# EAGLE design RMP - FBPS MOBO 0.0.1 (EAGLE 9.6.2)

## Sheet 1 of 4
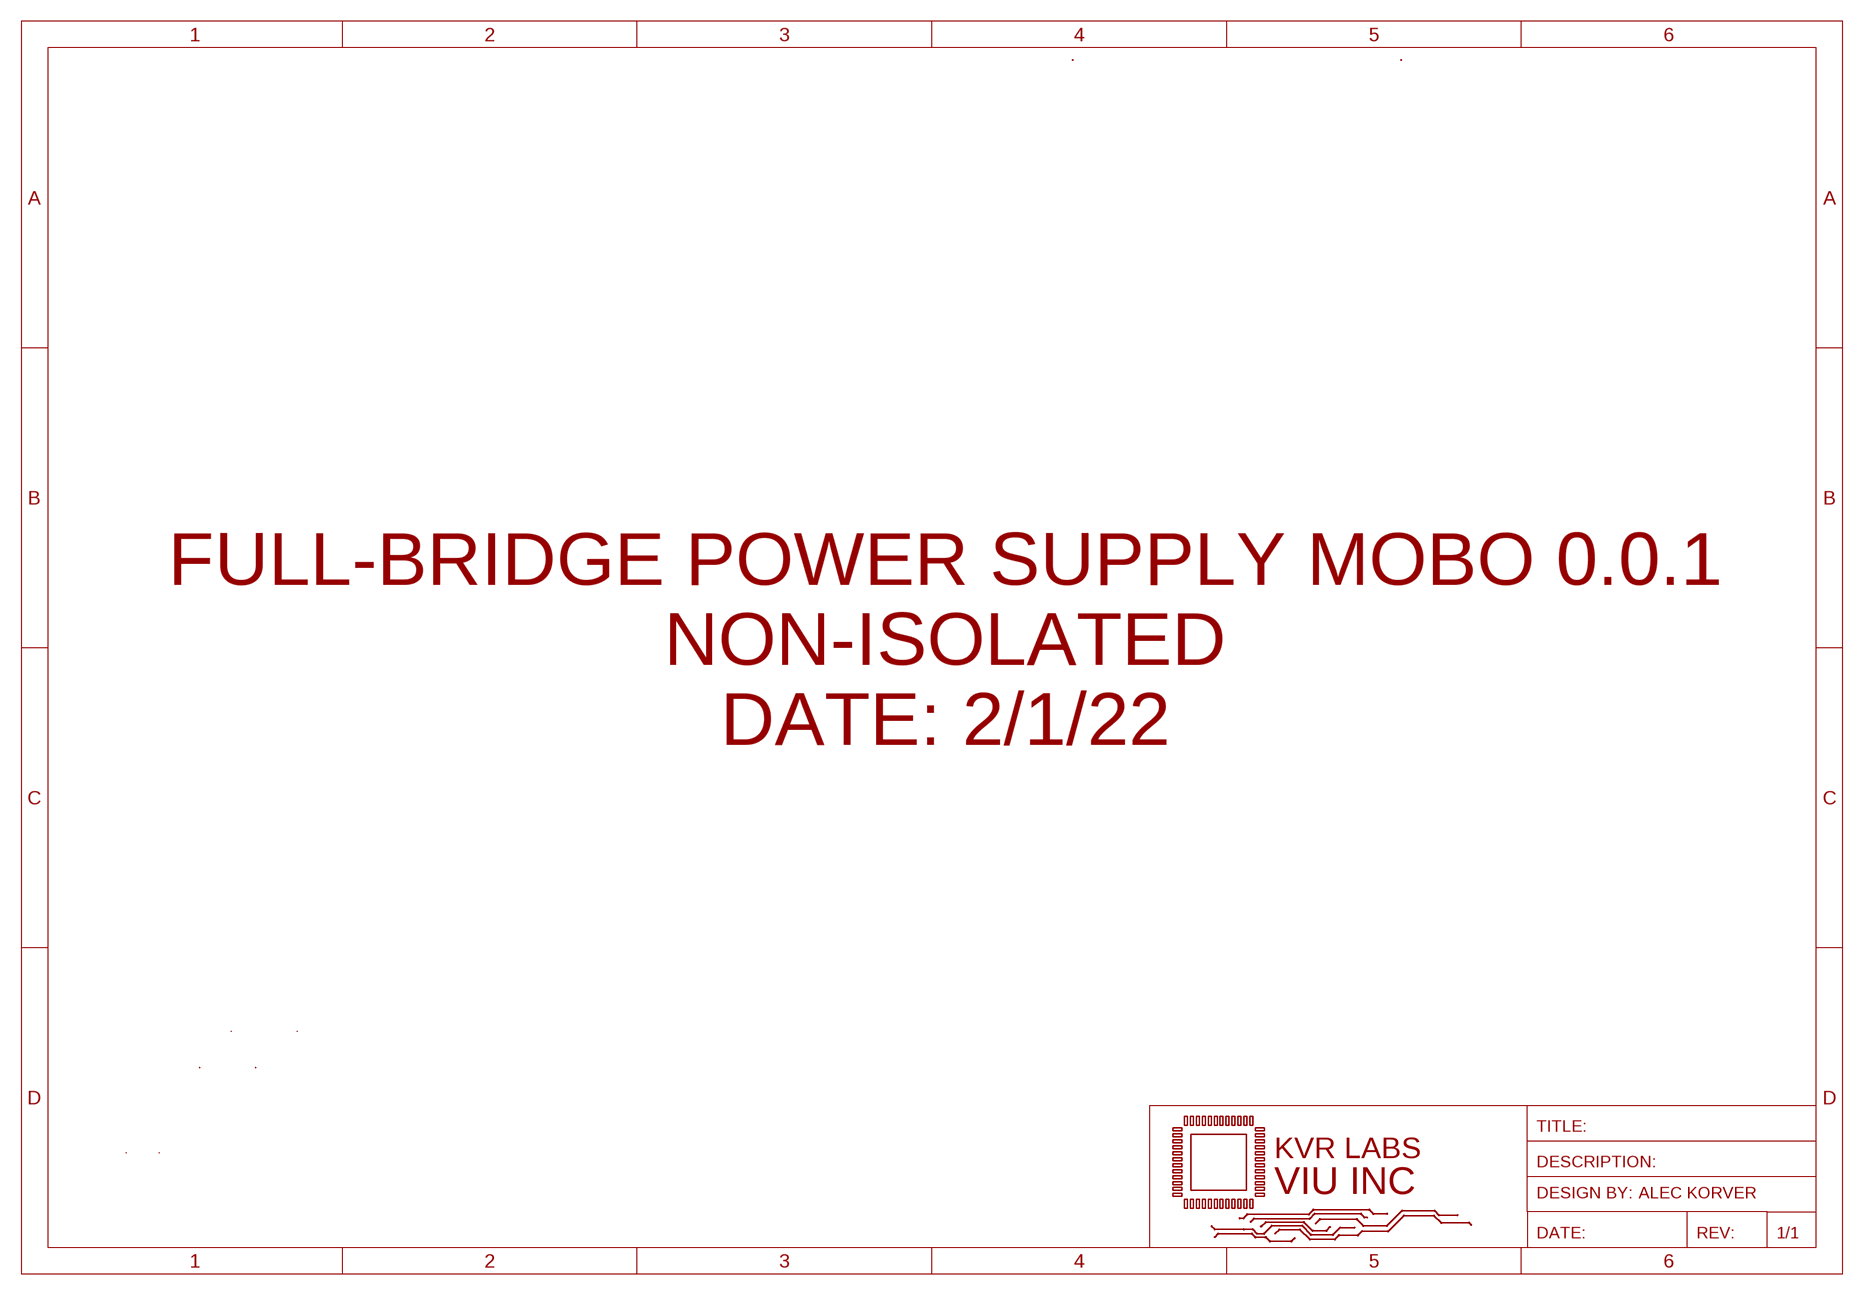
[diagram p0: schematic, sheet 1]

### Notes on the sheet
- FULL-BRIDGE POWER SUPPLY MOBO 0.0.1
  NON-ISOLATED
  DATE: 2/1/22

## Sheet 2 of 4: H BRIDGE - AC/DC STAGE
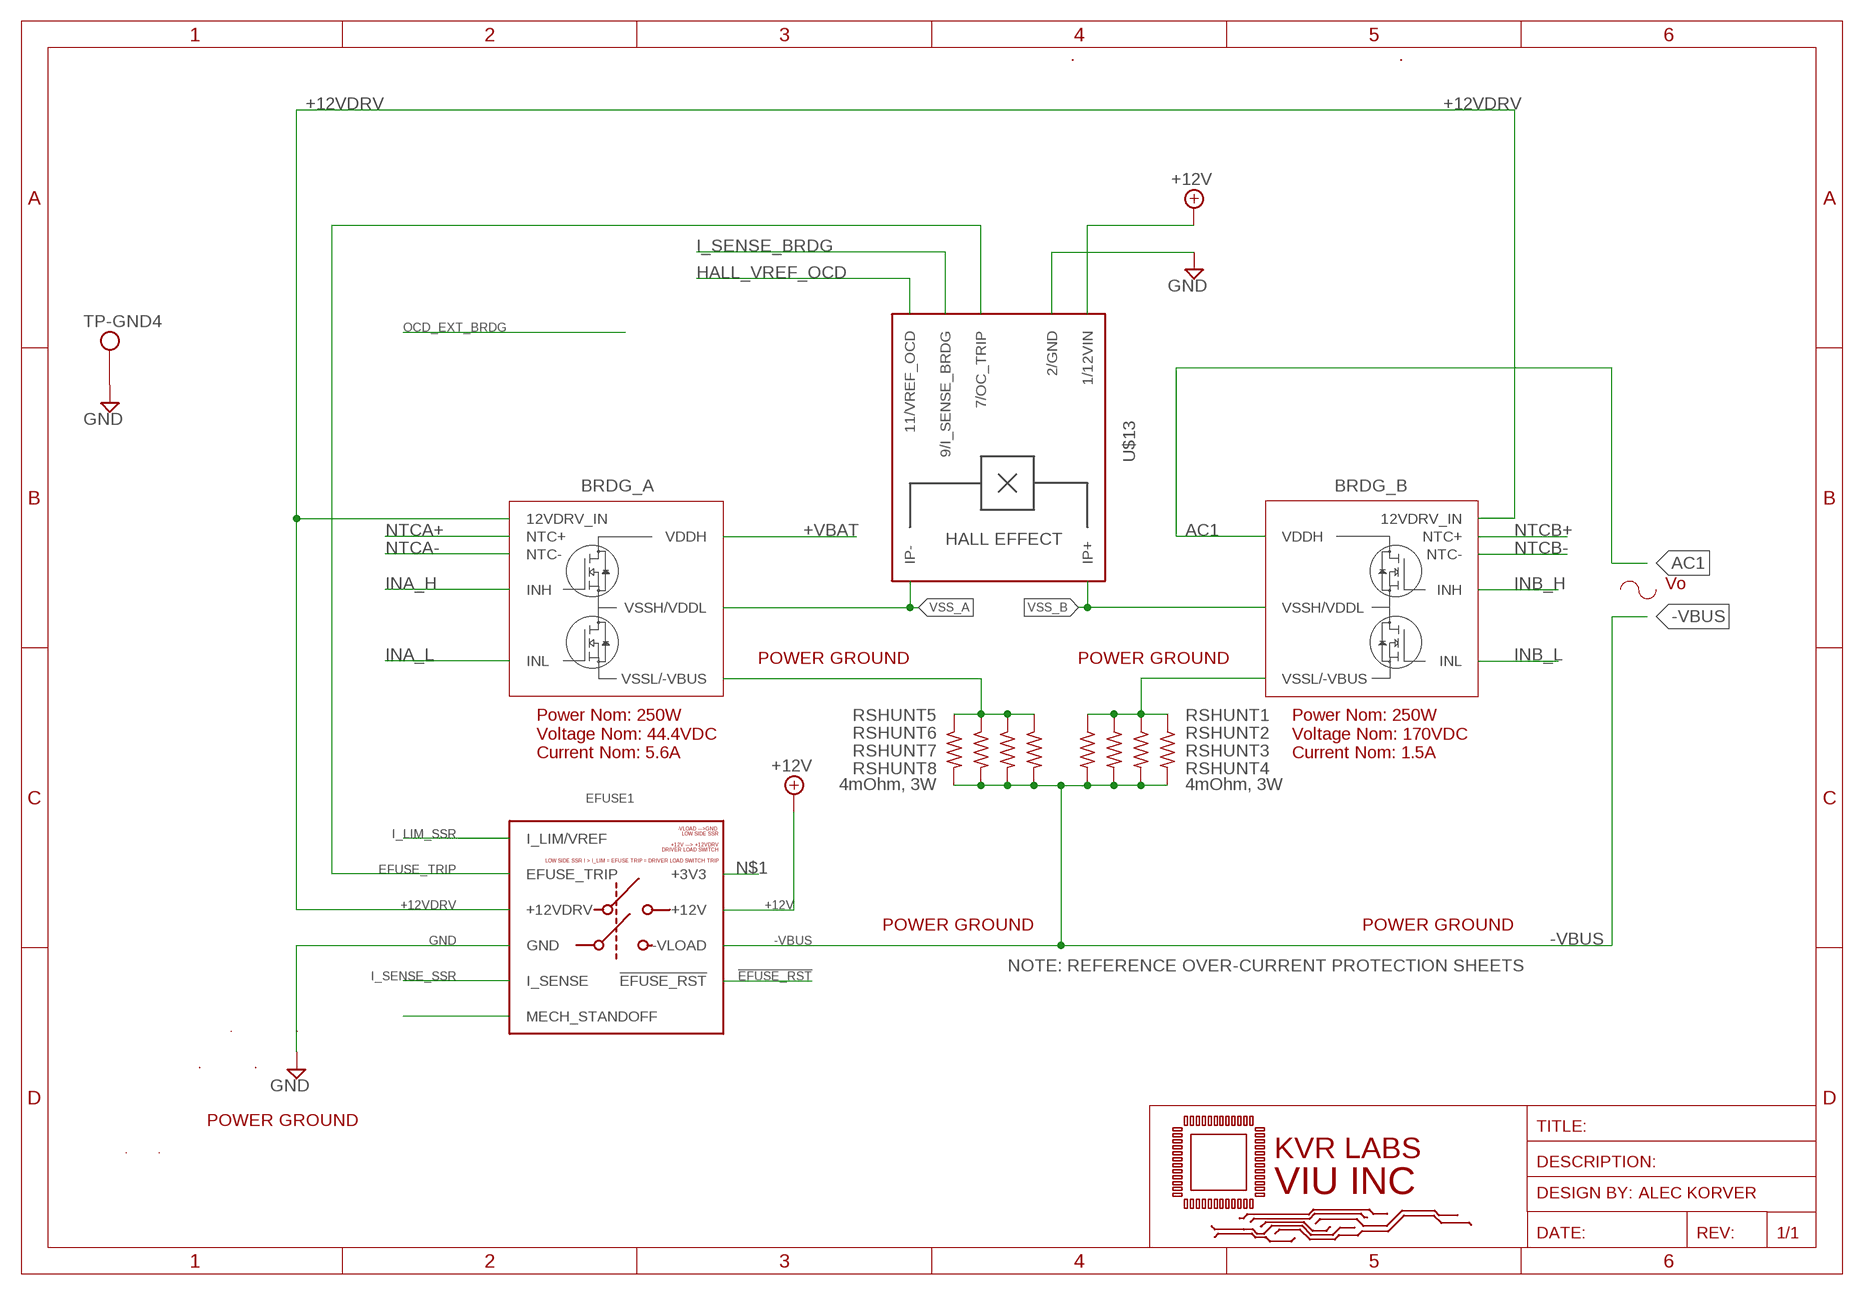
[diagram p1: schematic, sheet 2]

### Parts
BRDG_A  1/2BRIDGE  [1/2BRIDGE]
BRDG_B  1/2BRIDGE  [1/2BRIDGE]
EFUSE1  EFUSE_2.0.0  [EFUSE_2.0.0]
RSHUNT1  4mOhm, 3W  R-US_R2512  [R2512]
RSHUNT2  4mOhm, 3W  R-US_R2512  [R2512]
RSHUNT3  4mOhm, 3W  R-US_R2512  [R2512]
RSHUNT4  4mOhm, 3W  R-US_R2512  [R2512]
RSHUNT5  4mOhm, 3W  R-US_R2512  [R2512]
RSHUNT6  4mOhm, 3W  R-US_R2512  [R2512]
RSHUNT7  4mOhm, 3W  R-US_R2512  [R2512]
RSHUNT8  4mOhm, 3W  R-US_R2512  [R2512]
TP-GND4  THM_TESTPOINT_5000_SERIES  [THM-TESTPOINT]
U$13  HALL_EFFECT_CURRENT_MONITOR  [HALL_CURRENT_MONITOR]

### Nets
!EFUSE_RST: EFUSE1.12/!EFUSE_RST(!EFUSE_RST) ; also sheet 3
+12V: EFUSE1.11/12VIN(+12V) U$13.1/+12VIN(1/12VIN) ; also sheet 3
+12VDRV: BRDG_A.11/+12DRVR(12VDRV_IN) BRDG_B.11/+12DRVR(12VDRV_IN) EFUSE1.12/12VDRV(+12VDRV)
+VBAT: BRDG_A.1/VDDA(VDDH) BRDG_A.2/VDDA(VDDH) BRDG_A.3/VDDA(VDDH) BRDG_A.4/VDDA(VDDH) ; also sheet 3
-VBUS: EFUSE1.1/-VLOAD(-VLOAD) EFUSE1.2/-VLOAD(-VLOAD) EFUSE1.3/-VLOAD(-VLOAD) EFUSE1.4/-VLOAD(-VLOAD) EFUSE1.5/-VLOAD(-VLOAD) EFUSE1.6/-VLOAD(-VLOAD) EFUSE1.7/-VLOAD(-VLOAD) EFUSE1.8/-VLOAD(-VLOAD) RSHUNT1.2 RSHUNT2.2 RSHUNT3.2 RSHUNT4.2 RSHUNT5.2 RSHUNT6.2 RSHUNT7.2 RSHUNT8.2 ; also sheet 3,4
AC1: BRDG_B.1/VDDA(VDDH) BRDG_B.2/VDDA(VDDH) BRDG_B.3/VDDA(VDDH) BRDG_B.4/VDDA(VDDH) ; also sheet 3
EFUSE_TRIP: EFUSE1.10/EFUSE_TRIP(EFUSE_TRIP) U$13.7/EFUSE_TRIP(7/OC_TRIP) ; also sheet 3
GND: EFUSE1.1/GND(GND) EFUSE1.2/GND(GND) EFUSE1.3/GND(GND) EFUSE1.4/GND(GND) EFUSE1.5/GND(GND) EFUSE1.6/GND(GND) EFUSE1.7/GND(GND) EFUSE1.8/GND(GND) EFUSE1.9/GND(GND) TP-GND4.P1 U$13.2/GND U$13.3/GND(2/GND) ; also sheet 3,4
HALL_VREF_OCD: U$13.11/VREF_OCD
I_LIM_SSR: EFUSE1.11/VREF(I_LIM/VREF) ; also sheet 3
I_SENSE_BRDG: U$13.9/I_SENSE_BRDG ; also sheet 3
I_SENSE_SSR: EFUSE1.9/-VLOAD_SW(I_SENSE) ; also sheet 3
INA_H: BRDG_A.10/IN_H(INH) ; also sheet 3
INA_L: BRDG_A.9/IN_L(INL) ; also sheet 3
INB_H: BRDG_B.10/IN_H(INH) ; also sheet 3
INB_L: BRDG_B.9/IN_L(INL) ; also sheet 3
N$1: EFUSE1.10/+3V3(+3V3)
N$3: BRDG_A.9/-VBUS(VSSL/-VBUS) BRDG_A.10/-VBUS(VSSL/-VBUS) BRDG_A.11/-VBUS(VSSL/-VBUS) BRDG_A.12/-VBUS(VSSL/-VBUS) RSHUNT5.1 RSHUNT6.1 RSHUNT7.1 RSHUNT8.1
N$4: BRDG_B.9/-VBUS(VSSL/-VBUS) BRDG_B.10/-VBUS(VSSL/-VBUS) BRDG_B.11/-VBUS(VSSL/-VBUS) BRDG_B.12/-VBUS(VSSL/-VBUS) RSHUNT1.1 RSHUNT2.1 RSHUNT3.1 RSHUNT4.1
N$5: EFUSE1.S1(MECH_STANDOFF) EFUSE1.S2(MECH_STANDOFF)
NTCA+: BRDG_A.7/NTC+(NTC+) ; also sheet 3
NTCA-: BRDG_A.8/NTC-(NTC-) ; also sheet 3
NTCB+: BRDG_B.7/NTC+(NTC+) ; also sheet 3
NTCB-: BRDG_B.8/NTC-(NTC-) ; also sheet 3
VSS_A: BRDG_A.1/VSSA(VSSH/VDDL) BRDG_A.2/VSSA(VSSH/VDDL) BRDG_A.3/VSSA(VSSH/VDDL) BRDG_A.4/VSSA(VSSH/VDDL) U$13.7/IP-(IP-) U$13.8/IP-(IP-) U$13.9/IP-(IP-) U$13.10/IP-(IP-) U$13.11/IP-(IP-) U$13.12/IP-(IP-) ; also sheet 3
VSS_B: BRDG_B.1/VSSA(VSSH/VDDL) BRDG_B.2/VSSA(VSSH/VDDL) BRDG_B.3/VSSA(VSSH/VDDL) BRDG_B.4/VSSA(VSSH/VDDL) U$13.1/IP+(IP+) U$13.2/IP+(IP+) U$13.3/IP+(IP+) U$13.4/IP+(IP+) U$13.5/IP+(IP+) U$13.6/IP+(IP+) ; also sheet 3

### Notes on the sheet
- Vo
- POWER GROUND | POWER GROUND
- Power Nom: 250W
  Voltage Nom: 44.4VDC
  Current Nom: 5.6A
- Power Nom: 250W
  Voltage Nom: 170VDC
  Current Nom: 1.5A
- POWER GROUND | POWER GROUND
- NOTE: REFERENCE OVER-CURRENT PROTECTION SHEETS
- POWER GROUND

## Sheet 3 of 4: CONNECTORS
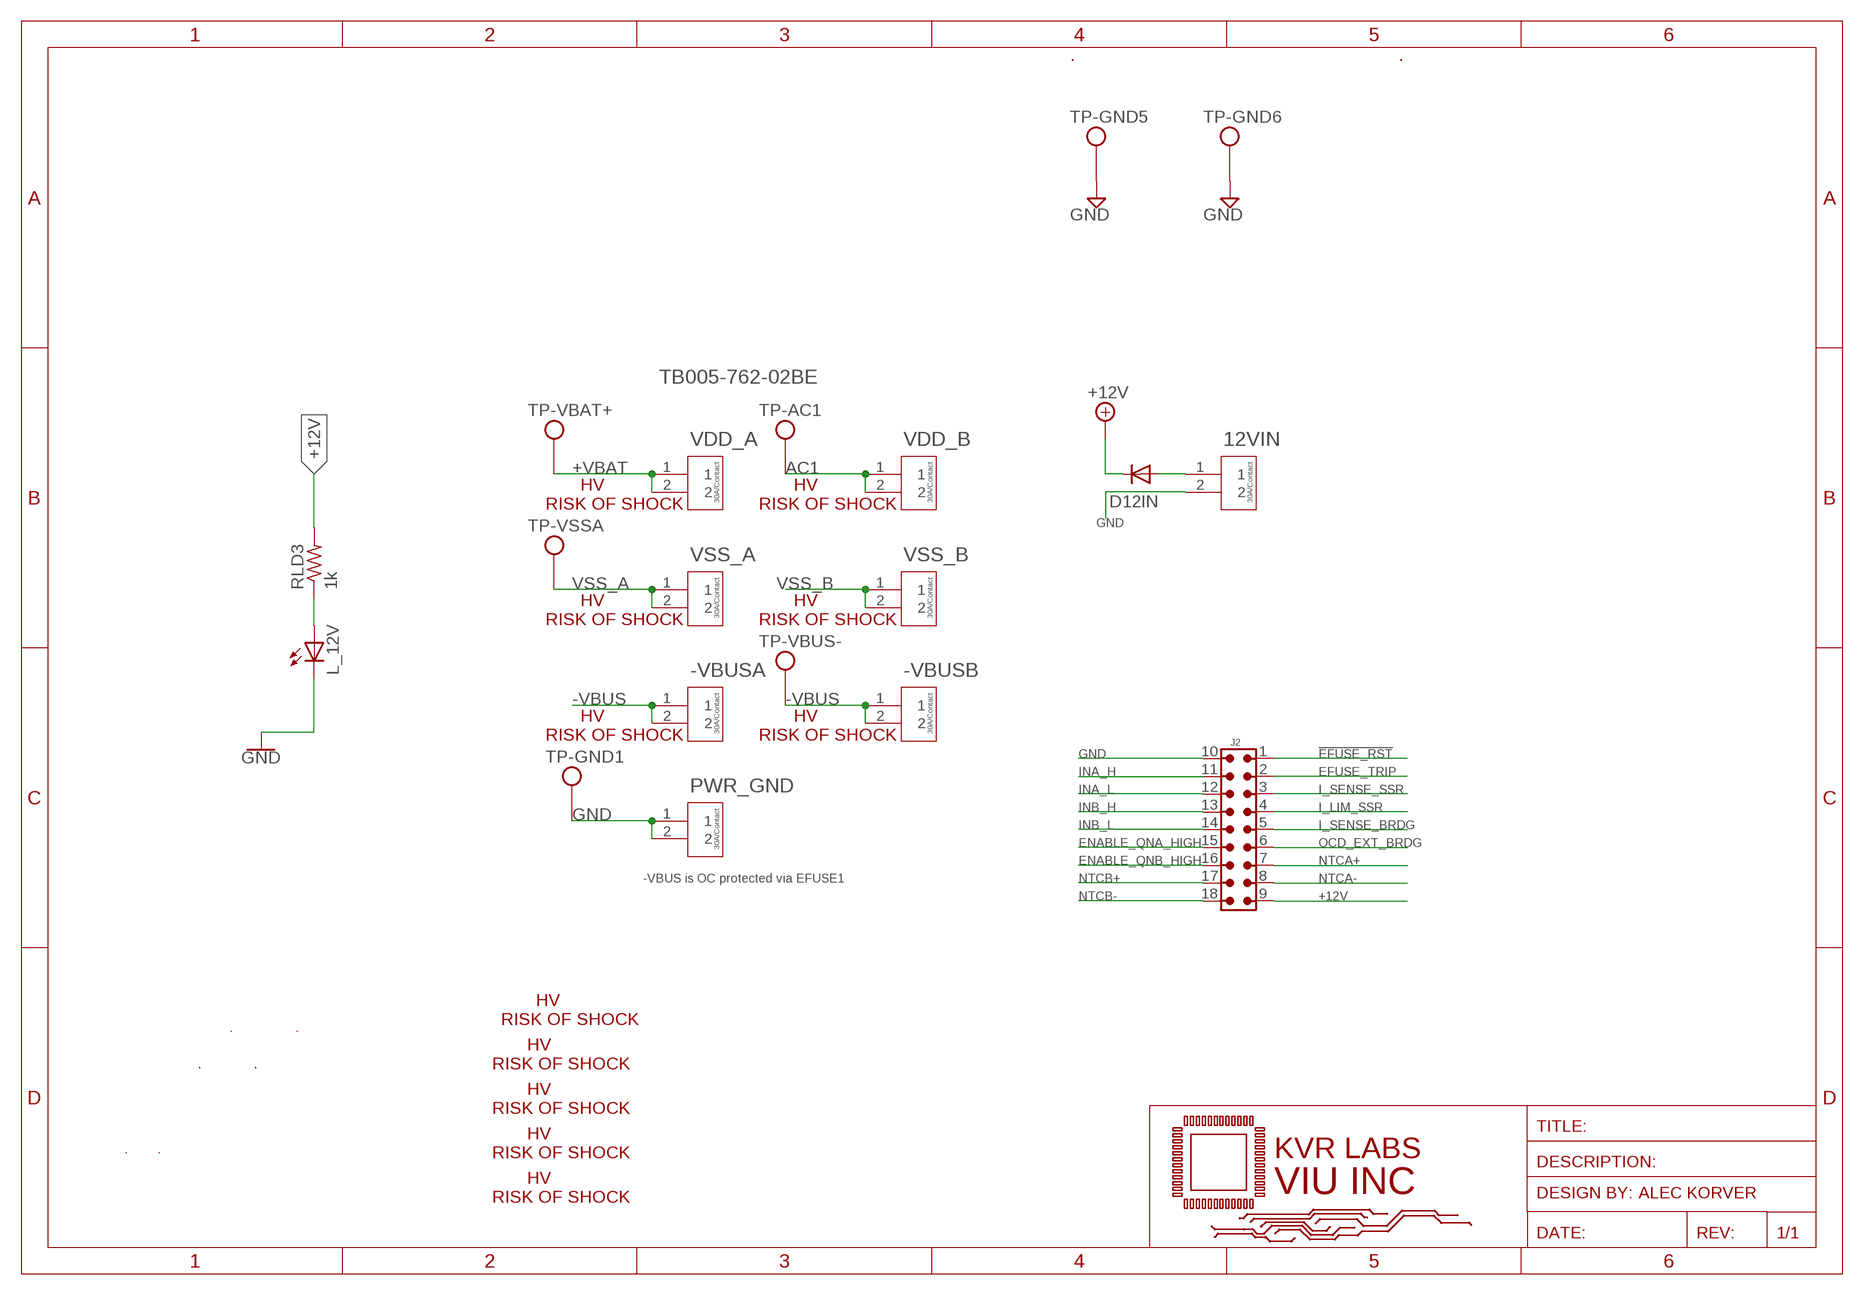
[diagram p2: schematic, sheet 3]

### Parts
12VIN  TB005-762-02BE  [TB005-762-02BE_CUD]
-VBUSA  TB005-762-02BE  [TB005-762-02BE_CUD]
-VBUSB  TB005-762-02BE  [TB005-762-02BE_CUD]
D12IN  DIODESMA  [SMADIODE]
J2  6620XX21022_66201821022  [66201821022]
L_12V  LEDCHIPLED_1206  [CHIPLED_1206]
PWR_GND  TB005-762-02BE  [TB005-762-02BE_CUD]
RLD3  1k  R-US_R1206  [R1206]
TP-AC1  THM_TESTPOINT_5000_SERIES  [THM-TESTPOINT]
TP-GND1  THM_TESTPOINT_5000_SERIES  [THM-TESTPOINT]
TP-GND5  THM_TESTPOINT_5000_SERIES  [THM-TESTPOINT]
TP-GND6  THM_TESTPOINT_5000_SERIES  [THM-TESTPOINT]
TP-VBAT+  THM_TESTPOINT_5000_SERIES  [THM-TESTPOINT]
TP-VBUS-  THM_TESTPOINT_5000_SERIES  [THM-TESTPOINT]
TP-VSSA  THM_TESTPOINT_5000_SERIES  [THM-TESTPOINT]
U$1  ELECTRIC_SHOCK  [ELECTRIC_SHOCK]
U$2  ELECTRIC_SHOCK  [ELECTRIC_SHOCK]
U$3  ELECTRIC_SHOCK  [ELECTRIC_SHOCK]
U$4  ELECTRIC_SHOCK  [ELECTRIC_SHOCK]
U$5  ELECTRIC_SHOCK  [ELECTRIC_SHOCK]
U$6  ELECTRIC_SHOCK  [ELECTRIC_SHOCK]
U$7  ELECTRIC_SHOCK  [ELECTRIC_SHOCK]
U$8  ELECTRIC_SHOCK  [ELECTRIC_SHOCK]
U$9  ELECTRIC_SHOCK  [ELECTRIC_SHOCK]
U$10  ELECTRIC_SHOCK  [ELECTRIC_SHOCK]
U$11  ELECTRIC_SHOCK  [ELECTRIC_SHOCK]
VDD_A  TB005-762-02BE  [TB005-762-02BE_CUD]
VDD_B  TB005-762-02BE  [TB005-762-02BE_CUD]
VSS_A  TB005-762-02BE  [TB005-762-02BE_CUD]
VSS_B  TB005-762-02BE  [TB005-762-02BE_CUD]

### Nets
!EFUSE_RST: J2.1 ; also sheet 2
+12V: D12IN.C J2.9 RLD3.2 ; also sheet 2
+VBAT: TP-VBAT+.P1 VDD_A.1 VDD_A.2 ; also sheet 2
-VBUS: -VBUSA.1 -VBUSA.2 -VBUSB.1 -VBUSB.2 TP-VBUS-.P1 ; also sheet 2,4
AC1: TP-AC1.P1 VDD_B.1 VDD_B.2 ; also sheet 2
EFUSE_TRIP: J2.2 ; also sheet 2
ENABLE_QNA_HIGH: J2.15
ENABLE_QNB_HIGH: J2.16
GND: 12VIN.2 J2.10 L_12V.C PWR_GND.1 PWR_GND.2 TP-GND1.P1 TP-GND5.P1 TP-GND6.P1 ; also sheet 2,4
I_LIM_SSR: J2.4 ; also sheet 2
I_SENSE_BRDG: J2.5 ; also sheet 2
I_SENSE_SSR: J2.3 ; also sheet 2
INA_H: J2.11 ; also sheet 2
INA_L: J2.12 ; also sheet 2
INB_H: J2.13 ; also sheet 2
INB_L: J2.14 ; also sheet 2
N$2: 12VIN.1 D12IN.A
N$20: L_12V.A RLD3.1
NTCA+: J2.7 ; also sheet 2
NTCA-: J2.8 ; also sheet 2
NTCB+: J2.17 ; also sheet 2
NTCB-: J2.18 ; also sheet 2
OCD_EXT_BRDG: J2.6 ; also sheet 2
VSS_A: TP-VSSA.P1 VSS_A.1 VSS_A.2 ; also sheet 2
VSS_B: VSS_B.1 VSS_B.2 ; also sheet 2

### Notes on the sheet
- -VBUS is OC protected via EFUSE1

## Sheet 4 of 4: CERAMIC DC LINK CAPACITANCE
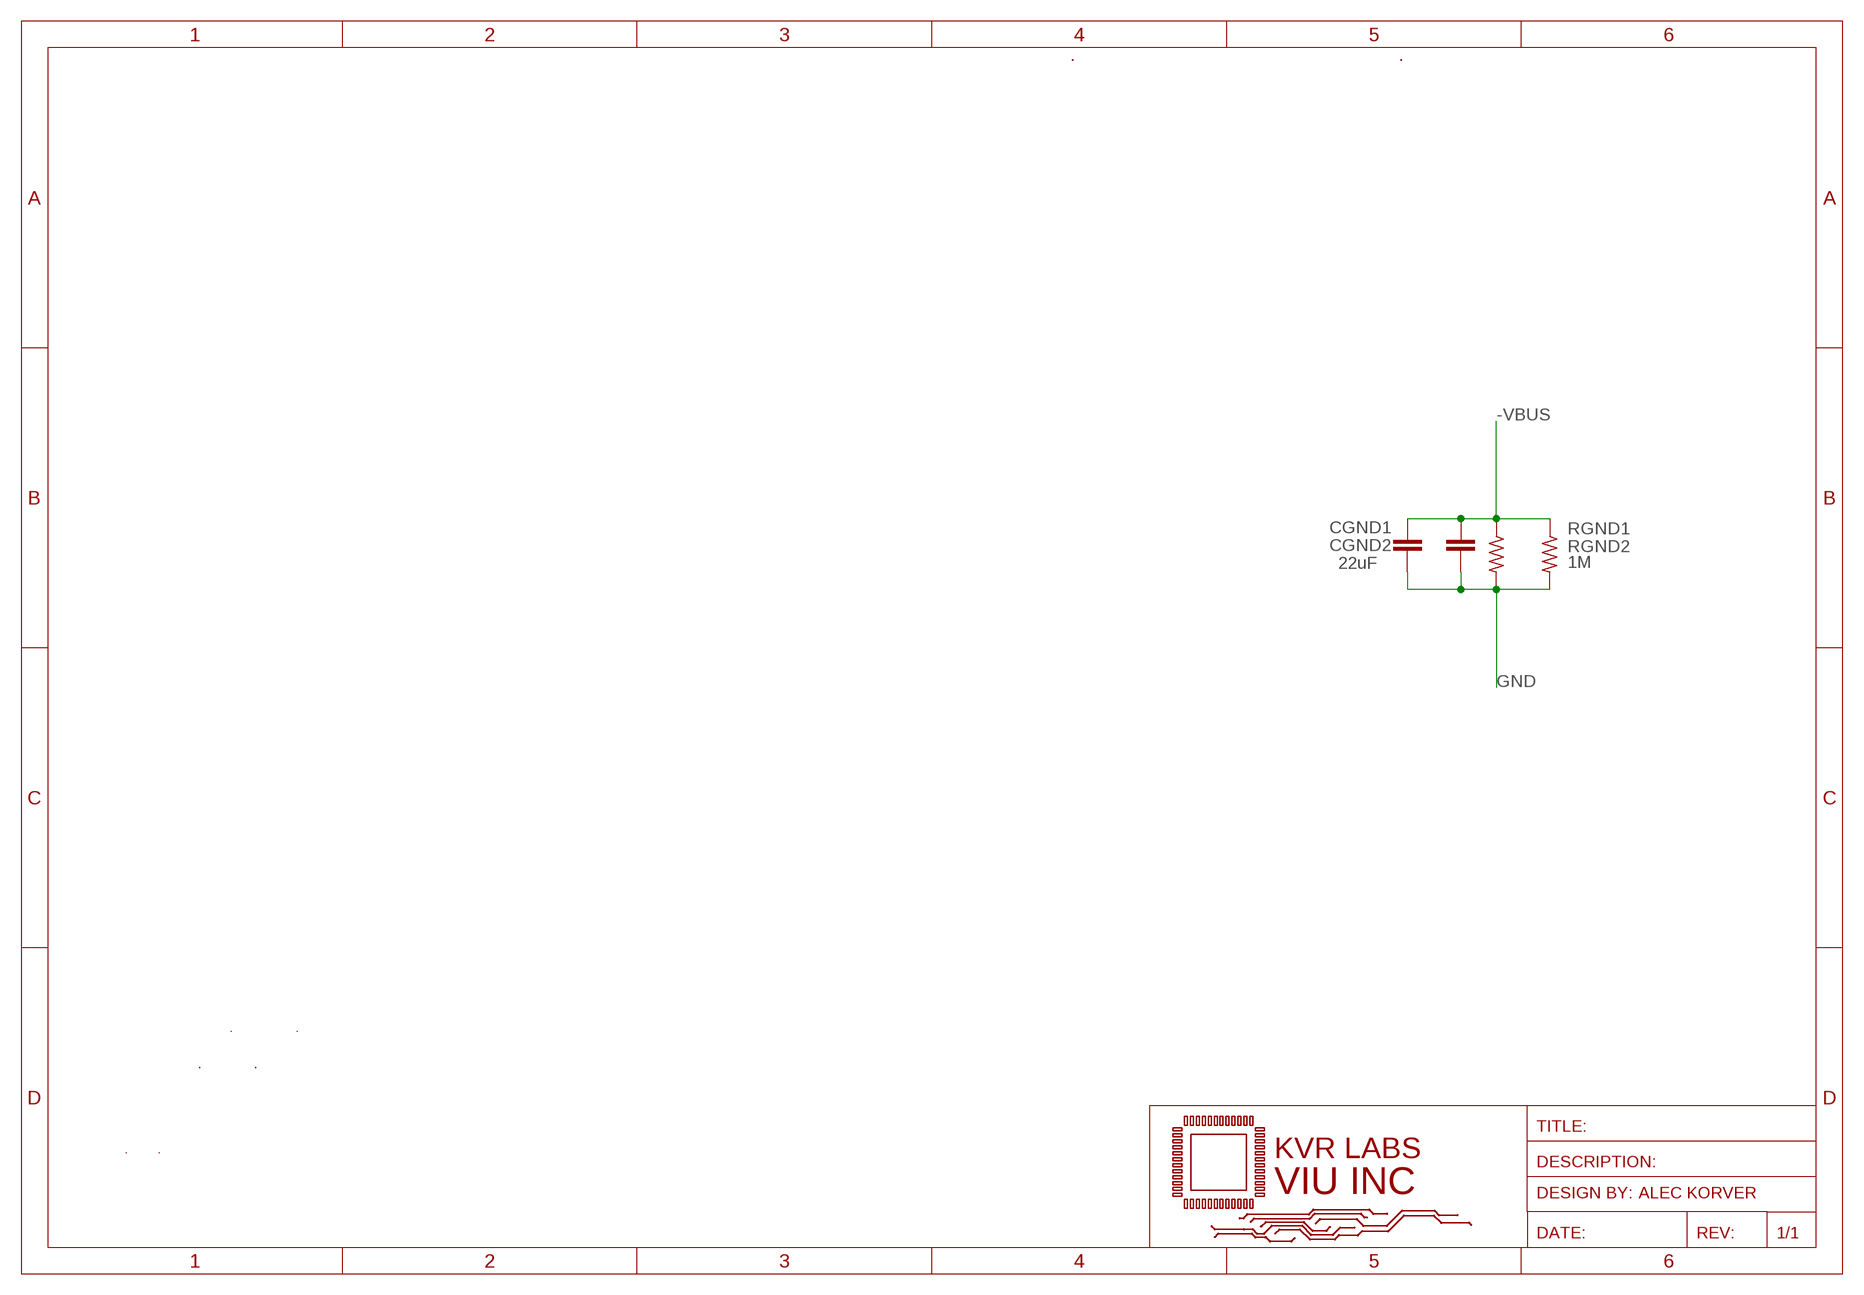
[diagram p3: schematic, sheet 4]

### Parts
CGND1  22uF  C-EUC1206  [C1206]
CGND2  22uF  C-EUC1206  [C1206]
RGND1  1M  R-US_R1206  [R1206]
RGND2  1M  R-US_R1206  [R1206]

### Nets
-VBUS: CGND1.1 CGND2.1 RGND1.1 RGND2.1 ; also sheet 2,3
GND: CGND1.2 CGND2.2 RGND1.2 RGND2.2 ; also sheet 2,3

## Library data of the parts
12VIN -VBUSA -VBUSB PWR_GND VDD_A VDD_B VSS_A VSS_B = KVRLABS-TERM BLOCKS:TB005-762-02BE; COPYRIGHT: Copyright (C) 2021 Ultra Librarian. All rights reserved.; DIGI-KEY_PART_NUMBER_1: 102-6189-ND; LCSC_PART: DNP; MANUFACTURER_PART_NUMBER: TB005-762-02BE; MFR_NAME: CUI Devices
BRDG_A BRDG_B = KVRLABS-POWER_STAGES:1/2BRIDGE; LCSC_PART: DNP/CUSTOM
CGND1 CGND2 = rcl:C-EU: CAPACITOR, European symbol; LCSC_PART: DNP/C77091; SPICEPREFIX: C
D12IN = adafruit:DIODE: Diode SMADIODE - SMA Surface Mount Package 20V 1A Schottky Diode Digikey: 641-1014-6-ND DO-1N4148 - Through Hole Small Current Diode SOD-123 20V 1 A (.5mV Vf) Schottky Diode - Digikey: MBRX120TPMSCT-ND SOD-323 10V 570mA (.38mV Vf, 3ns) Schottky Diode - Digikey: ZLLS410CT-ND SOD-523 30V 30mA Schottky Diode (RB751S-40TE61) - Digikey: RB751S-40TE61CT-ND SOT23-R/W - SOT23 Package (R = Solder Paste/Reflow Ovens, W = Hand-Soldering) BAT54Film 40V 300mA - Digikey: 497-7162-1-ND; I_AVG: 1A; LCSC_PART: C110531; VF: 1.3V; VR: 400V
EFUSE1 = KVRLABS-EFUSE:EFUSE_2.0.0; LCSC_PART: DNP/CUSTOM
J2 = Wurth_Connectors_WR-MPC3:6620XX21022_66201821022: WR-MPC3 3.00 mm Male Dual Row Angled Header w. Plastic Pegs KIND PROPERTIES Pitch 3 mm Gender Male MATERIAL PROPERTIES Insulator Material LCP Insulator Flammability Rating UL94 V-0 Insulator Color Black Contact Material Copper Alloy Contact Plating： Tin Contact Type Stamped GENERAL INFORMATION Operating Temperature -40 up to +105 °C Working Voltage 250 V (AC) Withstanding Voltage 1500 V (AC) Contact Resistance 10 mΩ RISO 1000 MΩ CERTIFICATION UL Approval E323964 WIRE PROPERTIES Packaging ：Tube <https://katalog.we-online.com/media/images/v2/o33169v209%20Family_WR-MPC3_6620xx21022.jpg> Details see: https://katalog.we-online.com/en/em/MPC3_3_00_MALE_DUAL_ROW_ANGLED_HEADER_W_PLASTIC_PEGS_6620XX21022 Created by Yingchun,Shan 2019-11-13 2019 (C) Würth Elektronik; CONTACT-RESISTANCE: 10Ohm; DATASHEET-URL: https://katalog.we-online.com/em/datasheet/66201821022.pdf; GENDER: Male; IR1: 5A; L: 30.7mm; LCSC_PART: DNP; MATE-WITH: WR-MPC3 3.00 mm Female Dual Row Receptacle; MOUNT: THT; PACKAGING: Tube; PART-NUMBER: 66201821022; PCB-CABLE-PANEL: PCB; PINS: 18; PITCH: 3mm; ROWS: Dual; TOL-R: max.; TYPE: Right Angled; WORKING-VOLTAGE: 250V(AC)
L_12V = adafruit:LED: LED OSRAM: - CHIPLED LG R971, LG N971, LY N971, LG Q971, LY Q971, LO R971, LY R971 LH N974, LH R974 LS Q976, LO Q976, LY Q976 LO Q996 - Hyper CHIPLED LW Q18S LB Q993, LB Q99A, LB R99A - SideLED LS A670, LO A670, LY A670, LG A670, LP A670 LB A673, LV A673, LT A673, LW A673 LH A674 LY A675 LS A676, LA A676, LO A676, LY A676, LW A676 LS A679, LY A679, LG A679 - Hyper Micro SIDELED® LS Y876, LA Y876, LO Y876, LY Y876 LT Y87S - SmartLED LW L88C, LW L88S LB L89C, LB L89S, LG L890 LS L89K, LO L89K, LY L89K LS L896, LA L896, LO L896, LY L896 - TOPLED LS T670, LO T670, LY T670, LG T670, LP T670 LSG T670, LSP T670, LSY T670, LOP T670, LYG T670 LG T671, LOG T671, LSG T671 LB T673, LV T673, LT T673, LW T673 LH T674 LS T676, LA T676, LO T676, LY T676, LB T676, LH T676, LSB T676, LW T676 LB T67C, LV T67C, LT T67C, LS T67K, LO T67K, LY T67K, LW E67C LS E67B, LA E67B, LO E67B, LY E67B, LB E67C, LV E67C, LT E67C LW T67C LS T679, LY T679, LG T679 LS T770, LO T770, LY T770, LG T770, LP T770 LB T773, LV T773, LT T773, LW T773 LH T774 LS E675, LA E675, LY E675, LS T675 LS T776, LA T776, LO T776, LY T776, LB T776 LHGB T686 LT T68C, LB T68C - Hyper Mini TOPLED® LB M676 - Mini TOPLED Santana® LG M470 LS M47K, LO M47K, LY M47K Source: http://www.osram.convergy.de/; LCSC_PART: C434439
RGND1 RGND2 = rcl:R-US_: RESISTOR, American symbol; LCSC_PART: DNP/C26124; SPICEPREFIX: R
RLD3 = rcl:R-US_: RESISTOR, American symbol; LCSC_PART: C115421; SPICEPREFIX: R
RSHUNT1-RSHUNT8 = rcl:R-US_: RESISTOR, American symbol; LCSC_PART: C728322; MODEL: PA2512FKF7T0R004E; SPICEPREFIX: R
TP-AC1 TP-GND1 TP-GND4-TP-GND6 TP-VBAT+ TP-VBUS- TP-VSSA = PSFBC:THM_TESTPOINT_5000_SERIES; LCSC_PART: DNP
U$1-U$11 = PSFBC:ELECTRIC_SHOCK; LCSC_PART: DNP
U$13 = KVRLABS-EFUSE:HALL_EFFECT_CURRENT_MONITOR; LCSC_PART: DNP/CUSTOM

## Net classes
0 default: width 0.089 mm, drill 0.2 mm, clearance 0.089 mm

## Board
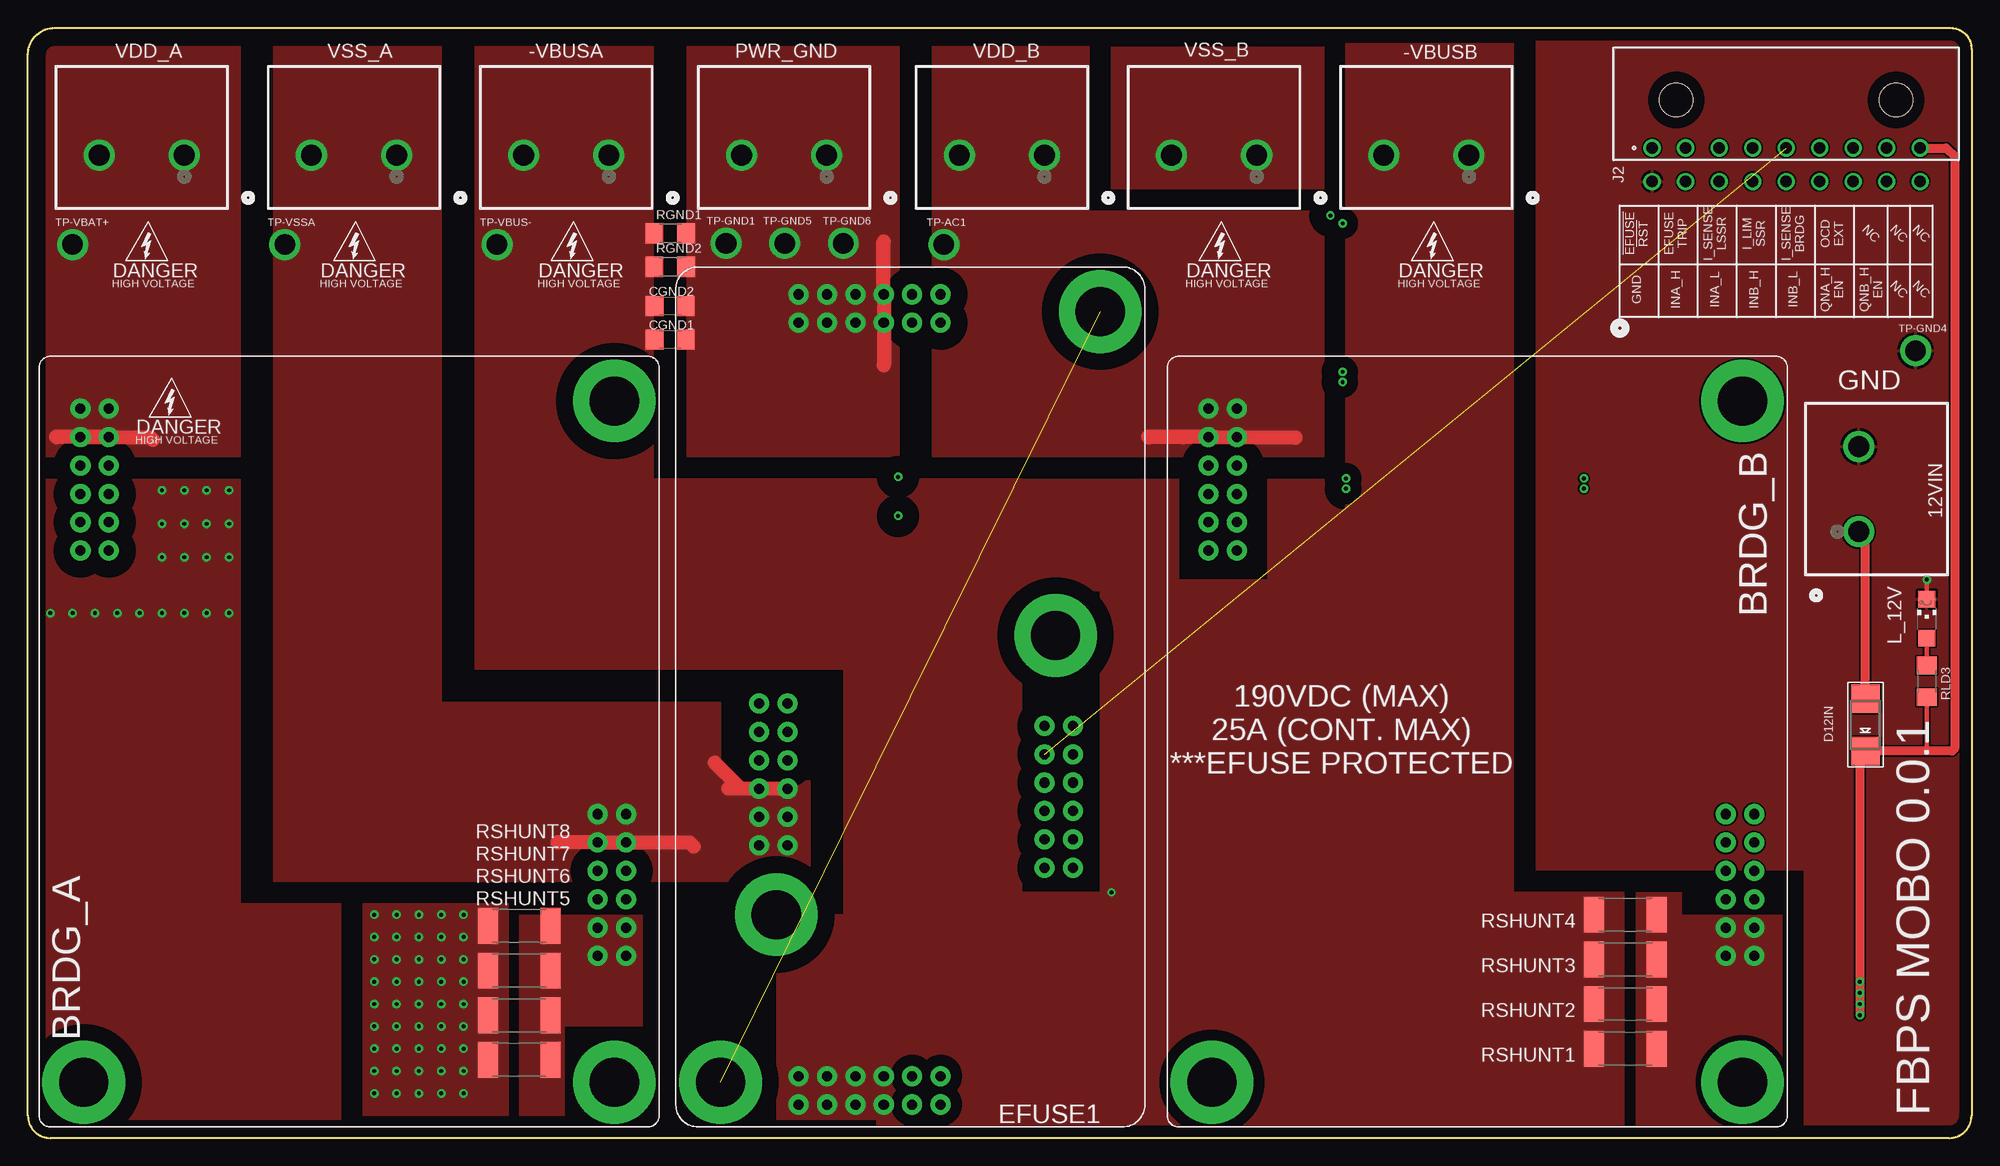
[diagram p4: board, top side]
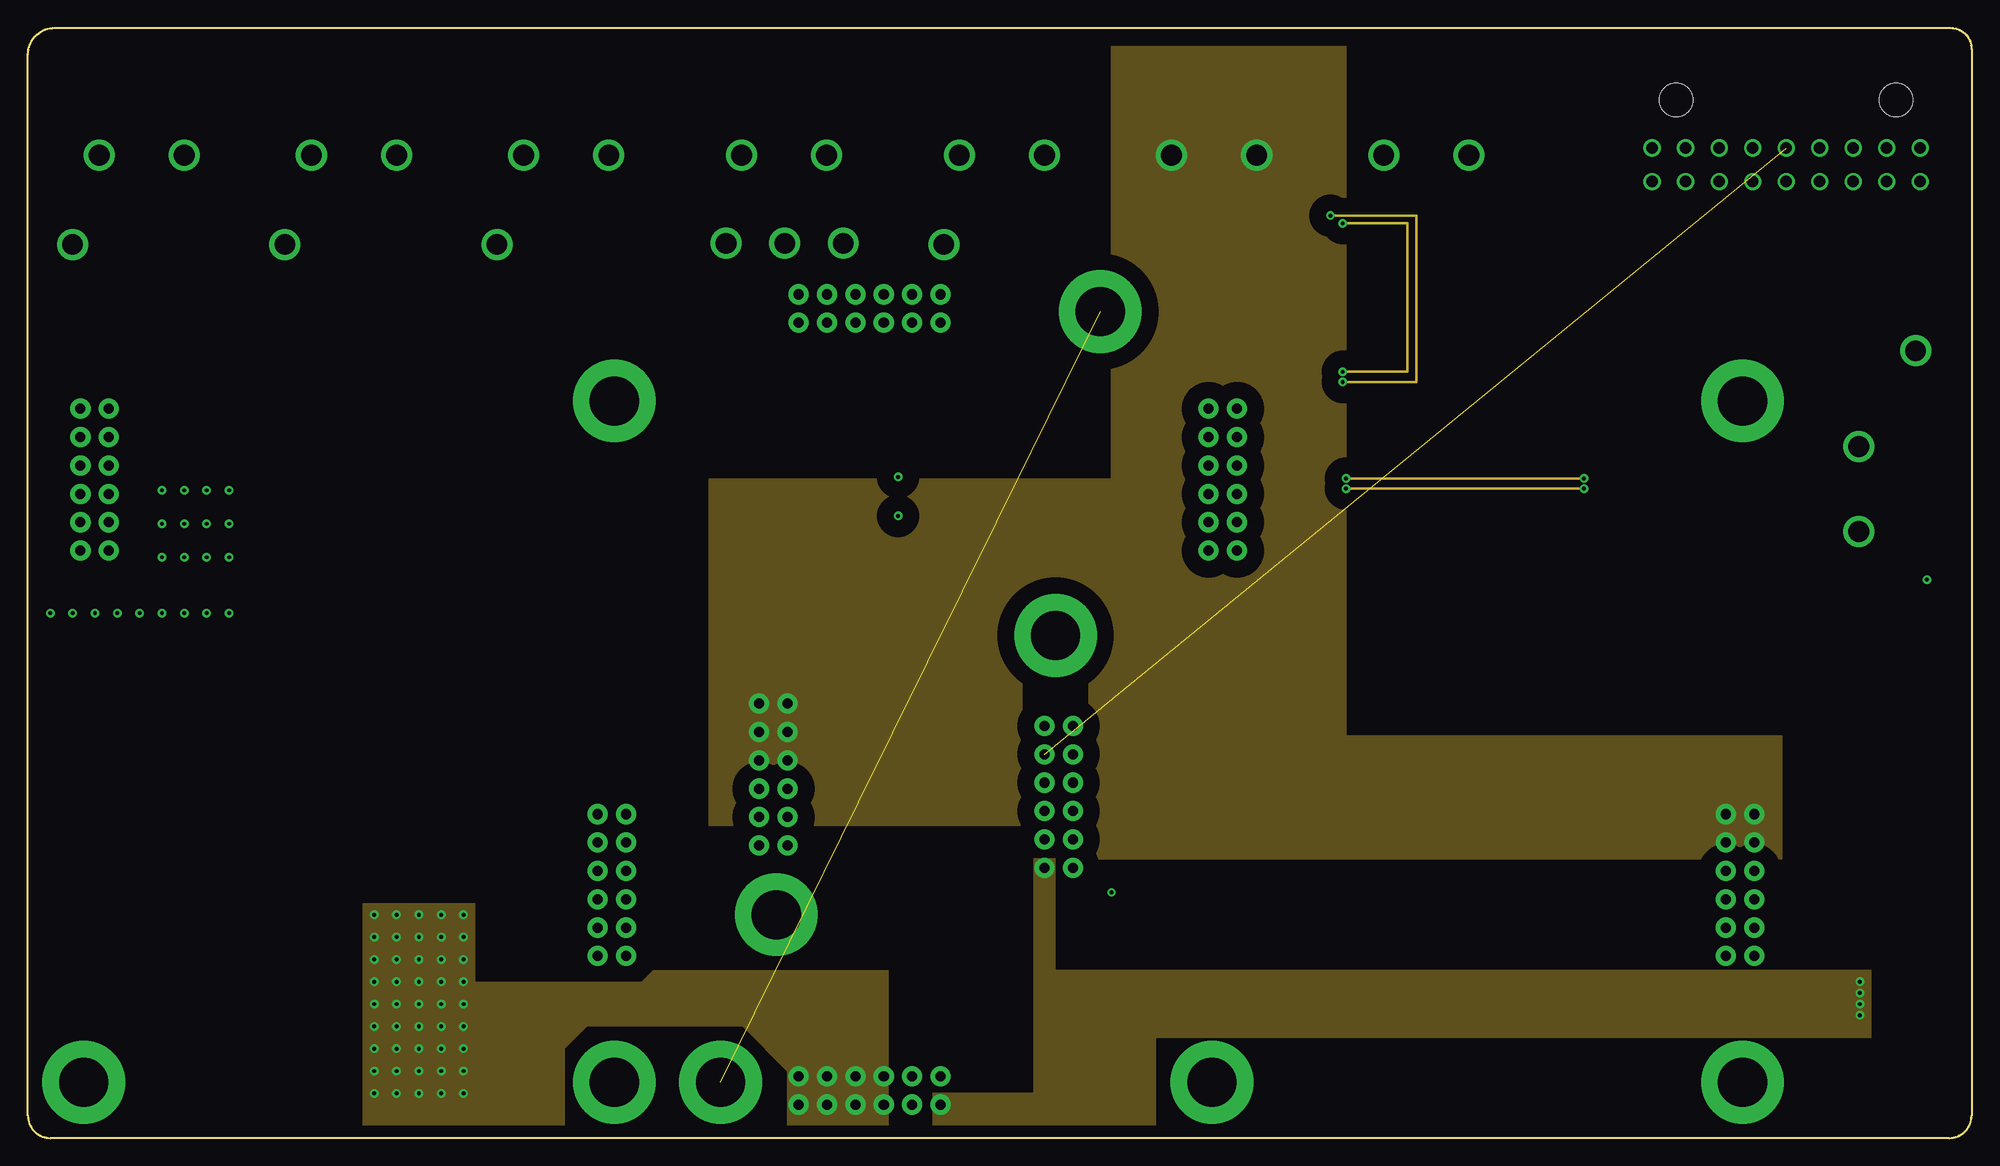
[diagram p5: board, inner layer Route2]
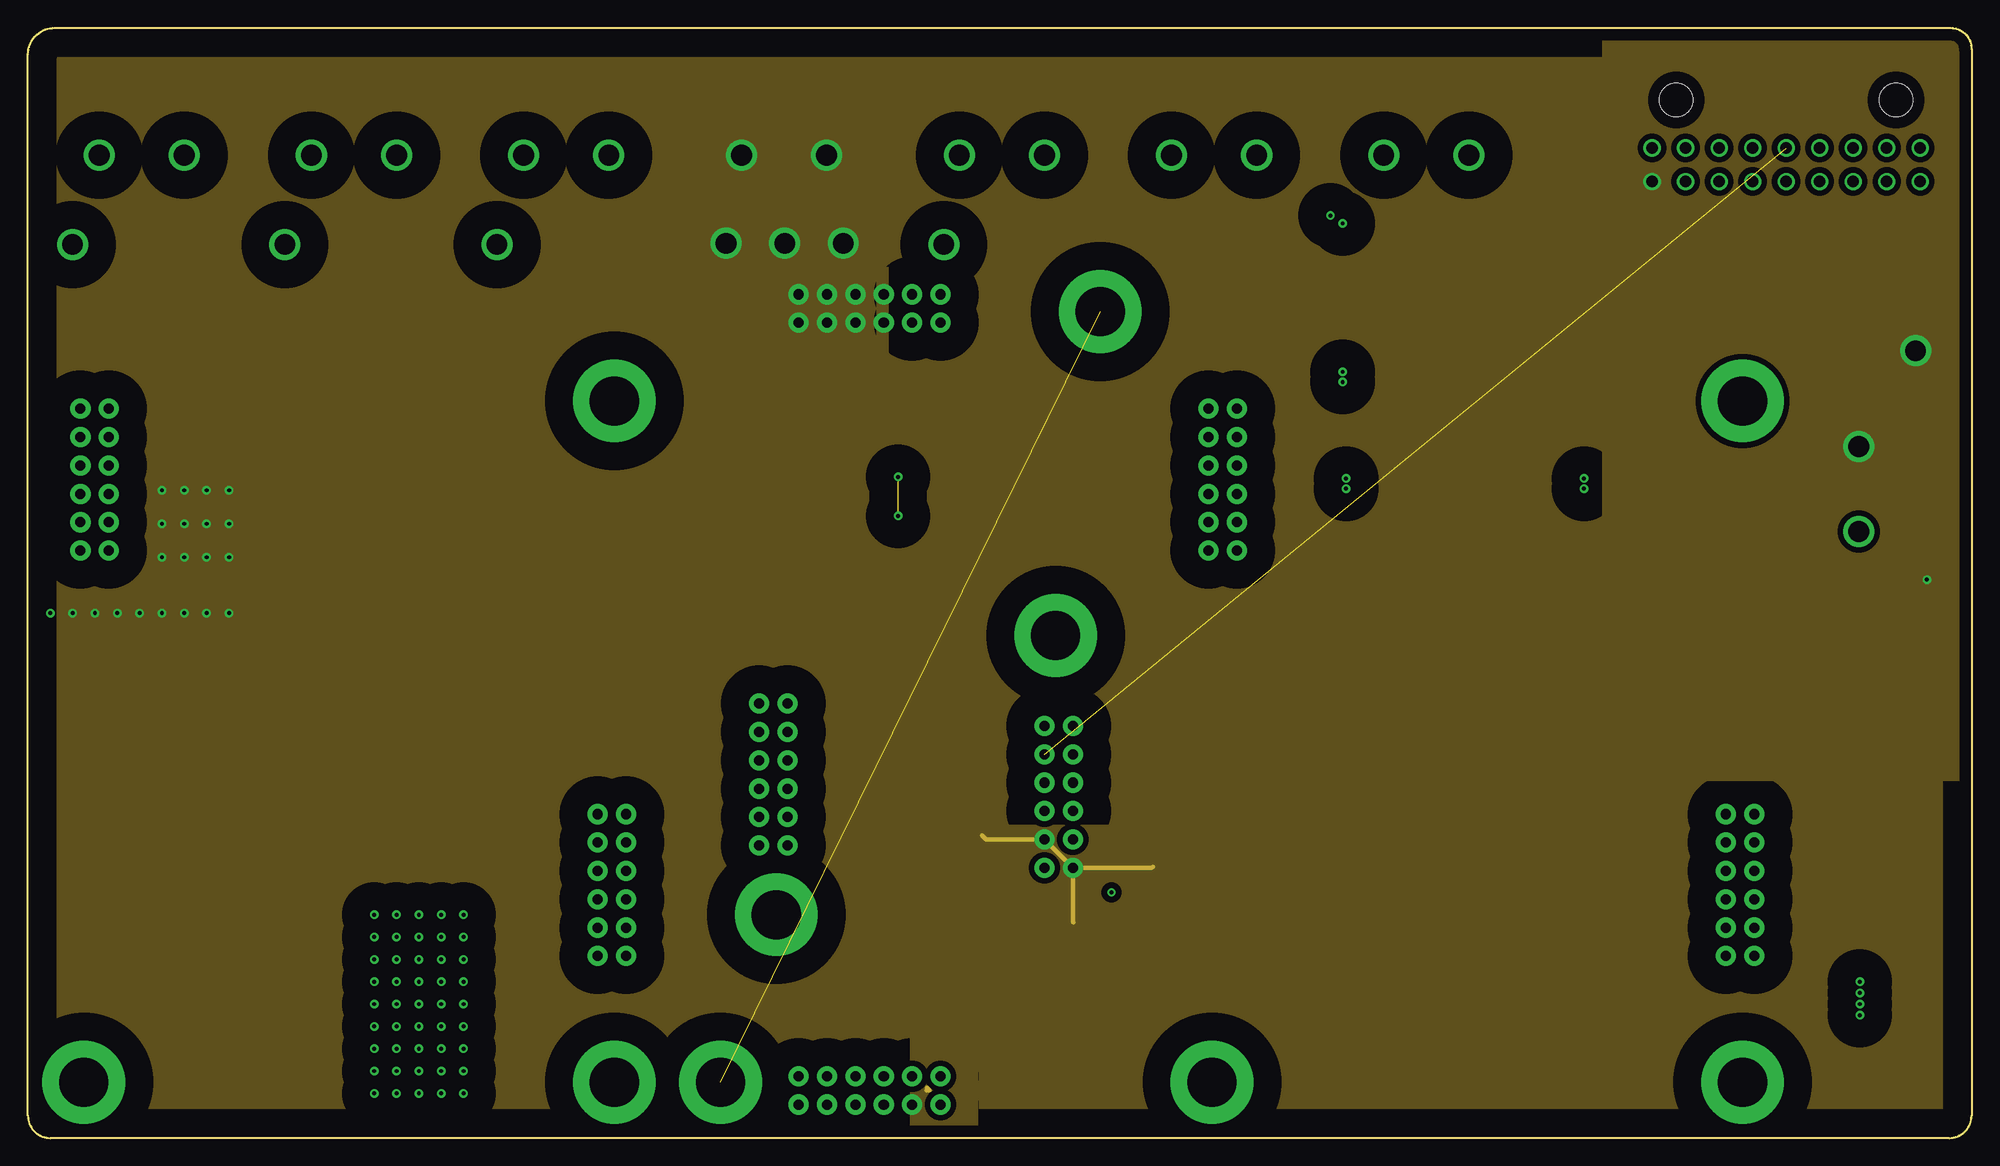
[diagram p6: board, inner layer Route15]
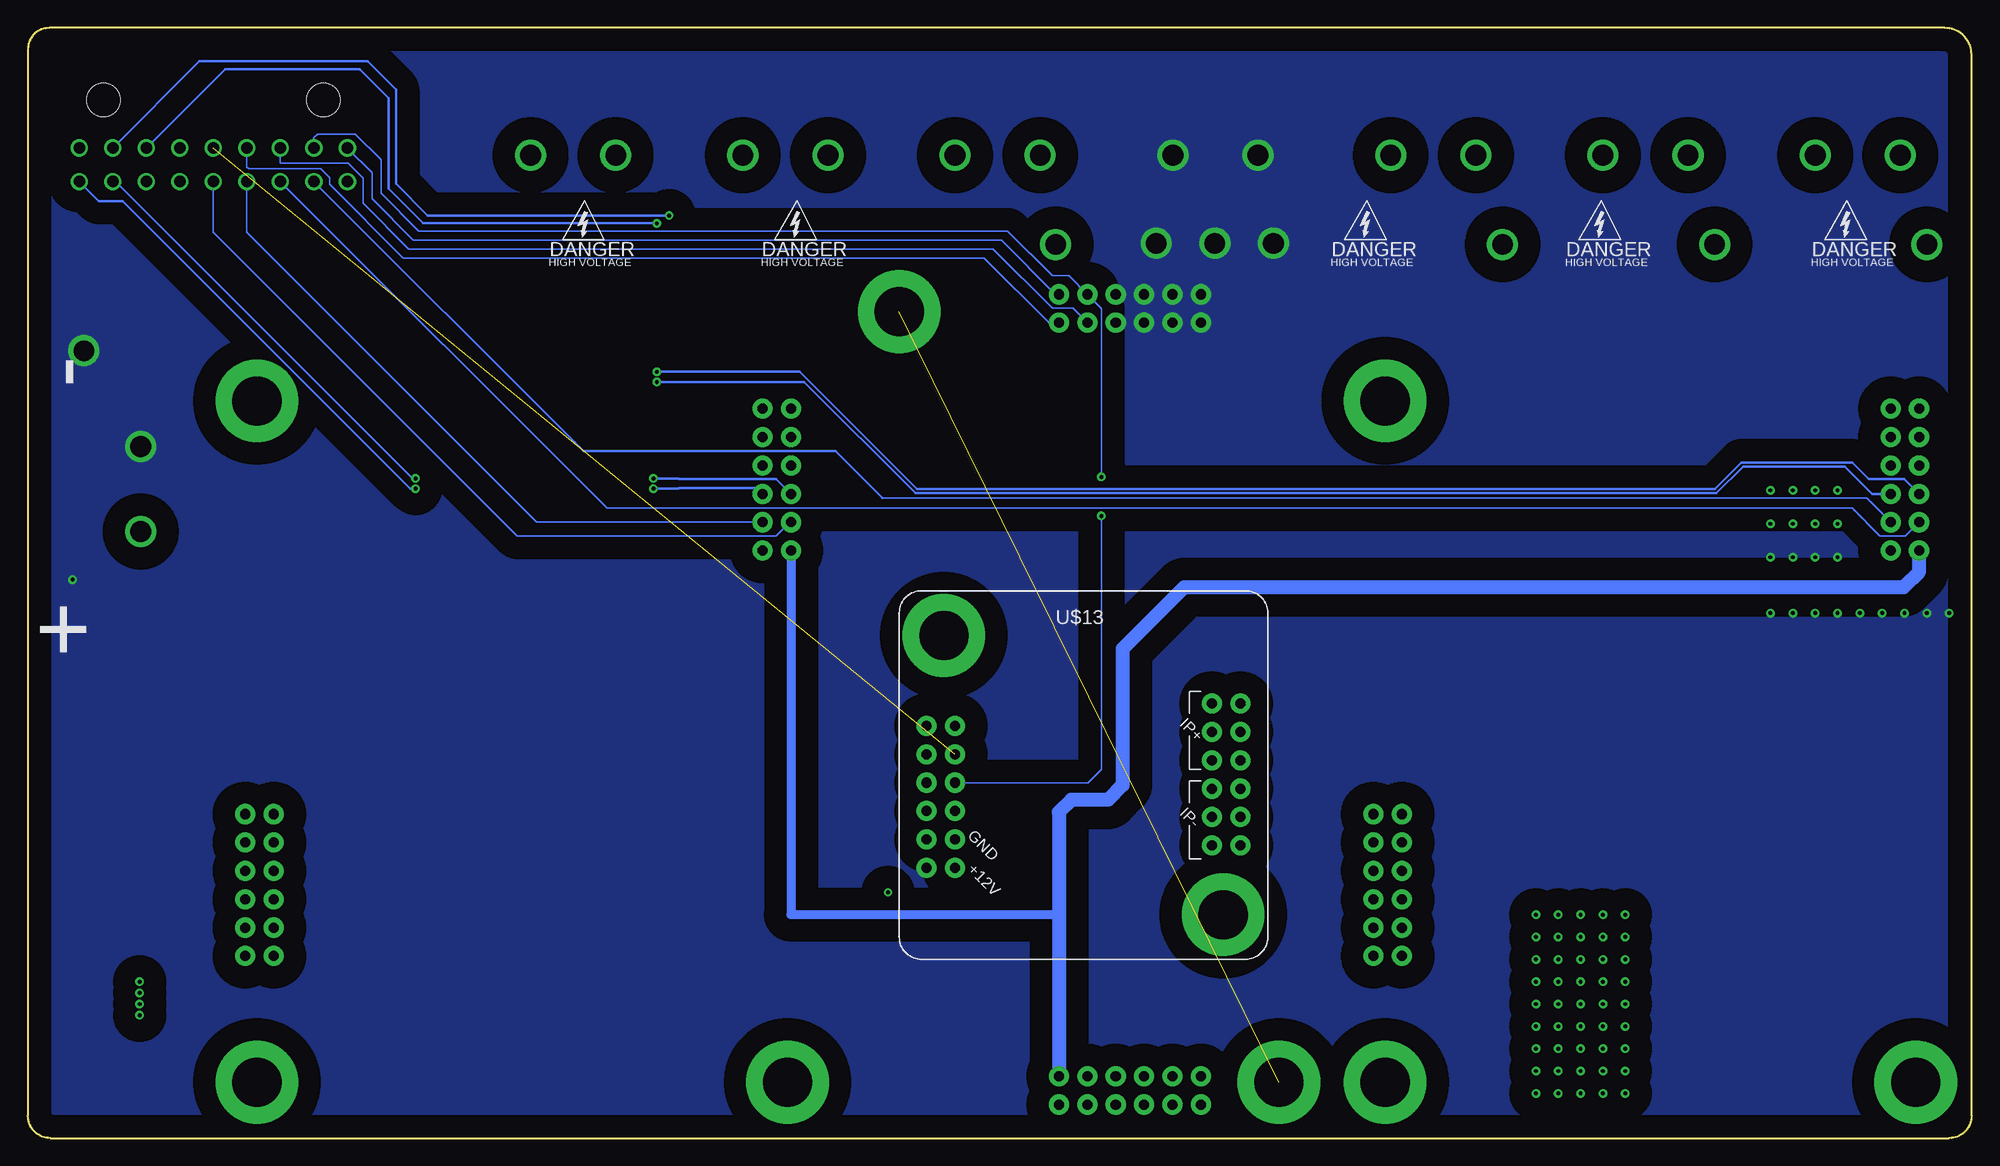
[diagram p7: board, bottom side, seen from below]

Size 174 x 99.4 mm. Coordinates in mm from the lower left corner, seen from the top.
Outline: 0,2 0,97 arc-90 2.4,99.4 172.1,99.4 arc-90 174,97.5 174,2 arc-90 172,0 2,0 arc-90 0,2
Copper layers (1*2*15*16): Top 0.035mm / dielectric 1.5mm / Route2 0.035mm / dielectric 0.15mm / Route15 0.035mm / dielectric 0.2mm / Bottom 0.035mm
Design rules "default *": minimum track width 6mil, minimum drill 0.35mm, track to track 6mil, track to pad 6mil, pad to pad 6mil, via to via 6mil, smd to smd 6mil, copper to edge 40mil, drill to drill 6mil, minimum pad ring 10mil, minimum via ring 8mil, stop-mask expansion 4mil, vias tented up to drill 0mil, thermal gap 10mil
bRestrict: area -181.5,10.5 to -180.5,12
vRestrict: 1 lines

### Footprints (pad centres in the part's own frame; a part is rotated, then mirrored left to right if it is on the bottom)
TB005-762-02BE_CUD = drill 1.854 pad 2.464: 1 0,0; 2 7.62,0
1/2BRIDGE = drill 0.9 pad 1.8: 1/VDDA 4.7,3.7; 1/VSSA 41,50; 2/VDDA 4.7,6.24; 2/VSSA 41,52.54; 3/VDDA 7.24,3.7; 3/VSSA 43.54,50; 4/VDDA 7.24,6.24; 4/VSSA 43.54,52.54; 5/NC1 9.78,3.7; 5/NC2 46.08,50; 6/NC1 46.08,52.54; 6/NC2 9.78,6.24; 7/NC3 48.62,50; 7/NTC+ 12.32,3.7; 8/NC4 48.62,52.54; 8/NTC- 12.32,6.24; 9/-VBUS 51.16,50; 9/IN_L 14.86,3.7; 10/-VBUS 51.16,52.54; 10/IN_H 14.86,6.24; 11/+12DRVR 17.4,3.7; 11/-VBUS 53.7,50; 12/-VBUS 53.7,52.54; 12/GND 17.4,6.24 | drill 4.4 pad 7.4: S1 4,51.5; S2 65,51.5; S3 65,4
C1206 = smd 1.6 x 1.8: 1 -1.4,0; 2 1.4,0
SMADIODE = smd 2.54 x 2.54: A 2.349,0; C -2.349,0
EFUSE_2.0.0 = drill 0.9 pad 1.8: 1/-VLOAD 11,2; 1/GND 11,72; 2/-VLOAD 11,4.54; 2/GND 11,74.54; 3/-VLOAD 13.54,2; 3/GND 13.54,72; 4/-VLOAD 13.54,4.54; 4/GND 13.54,74.54; 5/-VLOAD 16.08,2; 5/GND 16.08,72; 6/-VLOAD 16.08,4.54; 6/GND 16.08,74.54; 7/-VLOAD 18.62,2; 7/GND 18.62,72; 8/-VLOAD 18.62,4.54; 8/GND 18.62,74.54; 9/-VLOAD_SW 21.16,72; 9/GND 21.16,2; 10/+3V3 21.16,4.54; 10/EFUSE_TRIP 21.16,74.54; 11/12VIN 23.7,2; 11/VREF 23.7,72; 12/12VDRV 23.7,4.54; 12/!EFUSE_RST 23.7,74.54 | drill 4.4 pad 7.4: S1 4,4; S2 38,73
66201821022 = drill 1.02: 1 12,3.95; 2 9,3.95; 3 6,3.95; 4 3,3.95; 5 0,3.95; 6 -3,3.95; 7 -6,3.95; 8 -9,3.95; 9 -12,3.95; 10 12,6.95; 11 9,6.95; 12 6,6.95; 13 3,6.95; 14 0,6.95; 15 -3,6.95; 16 -6,6.95; 17 -9,6.95; 18 -12,6.95 | hole 3: 9.84,-0.35; -9.84,-0.35
CHIPLED_1206 = smd 1.5 x 1.5: A 0,-1.75; C 0,1.75
R1206 = smd 1.6 x 1.803: 1 -1.422,0; 2 1.422,0
R2512 = smd 1.8 x 3.2: 1 -2.8,0; 2 2.8,0
THM-TESTPOINT = drill 1.84: P1 0,0
HALL_CURRENT_MONITOR = drill 0.9 pad 1.8: 1/+12VIN 24.8,5; 1/IP+ 10.1,28; 2/GND 24.8,2.46; 2/IP+ 10.1,30.54; 3/GND 22.26,5; 3/IP+ 12.64,28; 4 22.26,2.46; 4/IP+ 12.64,30.54; 5 19.72,5; 5/IP+ 15.18,28; 6 19.72,2.46; 6/IP+ 15.18,30.54; 7/EFUSE_TRIP 17.18,5; 7/IP- 17.72,28; 8 17.18,2.46; 8/IP- 17.72,30.54; 9/I_SENSE_BRDG 14.64,5; 9/IP- 20.26,28; 10 14.64,2.46; 10/IP- 20.26,30.54; 11/IP- 22.8,28; 11/VREF_OCD 12.1,5; 12 12.1,2.46; 12/IP- 22.8,30.54 | drill 4.4 pad 7.4: S1 4,4; S2 29,29

### Placement (x,y rotation side)
12VIN  163.9,54.3 90 top
-VBUSA  52,88 180 top
-VBUSB  129,88 180 top
BRDG_A  1,70 270 top
BRDG_B  102,70 270 top
CGND1  57.5,71.5 0 top
CGND2  57.5,74.5 0 top
D12IN  164.5,37 90 top
EFUSE1  58,1 0 top
J2  157.4,92.6 180 top
L_12V  170,46.5 0 top
PWR_GND  71.5,88 180 top
RGND1  57.5,81 0 top
RGND2  57.5,78 0 top
RLD3  170,40.9 270 top
RSHUNT1  143,8 180 top
RSHUNT2  143,12 180 top
RSHUNT3  143,16 180 top
RSHUNT4  143,20 180 top
RSHUNT5  44,7 180 top
RSHUNT6  44,11 180 top
RSHUNT7  44,15 180 top
RSHUNT8  44,19 180 top
TP-AC1  82,80 270 top
TP-GND1  62.5,80.12 0 top
TP-GND4  169,70.5 0 top
TP-GND5  67.75,80.12 0 top
TP-GND6  73,80.12 0 top
TP-VBAT+  4,80 0 top
TP-VBUS-  42,80 0 top
TP-VSSA  23,80 0 top
U$1  126,80.35 0 top
U$2  29.5,80.35 0 top
U$3  13,66.35 0 top
U$4  107,80.35 0 top
U$5  49,80.35 0 top
U$6  10.9,80.35 0 top
U$7  124,82.25 0 bottom
U$8  105,82.25 0 bottom
U$9  11,82.25 0 bottom
U$10  33,82.25 0 bottom
U$11  54,82.25 0 bottom
U$13  96,49 270 bottom
VDD_A  14,88 180 top
VDD_B  91,88 180 top
VSS_A  33,88 180 top
VSS_B  110,88 180 top

### Tracks (layer width: path | path; a pad name or v marks a point on that pad's centre or on a via)
!EFUSE_RST
  Bottom 0.152: EFUSE1.12/!EFUSE_RST 82,75.54 86.86,80.4 139.5,80.4 143.2,84.1 143.2,86.45 J2.1
+12V  (via drill 0.35)
  Top 0.406: D12IN.C 169.65,34.65 170,35 RLD3.2
  Top 0.813: v164,11 v164,14 164,34.15 D12IN.C 172.25,34.65 172.48,34.88 172.48,87.9 171.73,88.65 J2.9
  other vias: 164,13 164,12
  pour Route2 (no thermals): 165,15 92,15 92,25 90,25 90,9 165,9
  pour Route2 (no thermals): 81,4 81,-2 101,-2 101,15 90,15 90,4
+12VDRV
  Bottom 0.813: BRDG_B.11/+12DRVR 105.7,20 81.7,20
  Bottom 1.27: BRDG_A.11/+12DRVR 4.7,50.7 6.1,49.3 70.5,49.3 76,43.8 76,31.6 77.3,30.3 80.6,30.3 81.7,29.2 81.7,20 EFUSE1.12/12VDRV
+VBAT
  Top 1.27: BRDG_A.3/VDDA 10.94,62.76 11.2,62.5 | BRDG_A.4/VDDA 2.54,62.76 2.5,62.8
  pour Top (isolate 1.5, no thermals): -4,61 19,61 19,102 -4,102
-VBUS  (via drill 0.35)
  other vias: 97,22 31,20 31,18 33,18 33,20 35,20 35,18 37,18 37,20 39,20 39,18 39,16 37,16 35,16 33,16 31,16 31,14 33,14 35,14 37,14 39,14 31,12 33,12 35,12 37,12 39,12 31,10 33,10 35,10 37,10 39,10 39,8 37,8 35,8 33,8 31,8 31,6 33,6 35,6 37,6 39,6 39,4 37,4 35,4 33,4 31,4
  pour Top (isolate 1, rank 2, no thermals): 76,22 157,22 157,-12 76,-12
  pour Top (isolate 1, no thermals): 118,98 118,-8 133,-8 133,98
  pour Top (isolate 1.5, no thermals): 67,20 67,-3 76,-3 76,18 89,18 89,59 56,59 56,100 40,100 40,42 73,42 73,20
  pour Top (isolate 1.5, no thermals): 96,20 96,49 88,49 88,59 103,59 103,50 111,50 111,59 124,59 124,22 98,22
  pour Top (isolate 0.5, no thermals): 30,21 43,21 43,2 30,2
  pour Route2 (isolate 0.5, no thermals): 30,-9 30,21 40,21 40,14 55,14 56,15 77,15 77,-2 68,-2 68,6 64,10 50,10 48,8 48,-9
AC1
  Top 1.27: 100.3,62.8 100.34,62.76 103.4,62.76 BRDG_B.3/VDDA 113.44,62.76 113.5,62.7
  pour Top (isolate 1.5, no thermals): 81,101 81,61 116,61 116,83 95,83 95,101
EFUSE_TRIP  (via drill 0.35)
  Route15 0.152: v77.9,59.2 v77.9,55.7
  Bottom 0.152: J2.2 148.4,89.55 148.05,89.9 144.7,89.9 142.4,87.6 142.4,84.6 139,81.2 86.3,81.2 82.3,77.2 80.82,77.2 EFUSE1.10/EFUSE_TRIP 77.9,74.28 v77.9,59.2 | v77.9,55.7 77.9,33 79.08,31.82 U$13.7/EFUSE_TRIP
GND  (via drill 0.35)
  Top 0.406: L_12V.C v170,50
  Top 1.27: 76.6,69.2 76.62,69.22 EFUSE1.8/GND 76.6,75.56 76.6,80.3
  Route15 0.406: 80.46,4.3 80.7,4.3 80.5,4.5 | U$13.2/GND 93.54,19.36 93.6,19.3 | U$13.2/GND 100.6,24.2 100.7,24.3 | 85.4,27.1 85.76,26.74 U$13.3/GND U$13.2/GND
  other vias: 12,52 14,52 16,52 18,52 18,55 16,55 14,55 12,55 12,47 14,47 16,47 18,47 10,47 8,47 6,47 4,47 2,47 12,58 14,58 16,58 18,58
  pour Top (isolate 1.5, no thermals): 78,61 78,102 59,102 59,61
  pour Route15 (isolate 2.5, rank 6, no thermals): 0,100 0,0 175,0 175,100
  pour Route15 (isolate 0.5, no thermals): 87,28 87,21 87,18 101,18 101,28
  pour Route15 (isolate 0.5, no thermals): 79,-1 79,10 85,10 85,-1
  pour Route15 (isolate 0.5, no thermals): 141,32 141,101 175,101 175,32
  pour Route15 (isolate 0.5, no thermals): 77,78 77,70 76,70 76,78
  pour Top: 135,103 135,24 159,24 159,-2 178,-2 178,103
  pour Top (isolate 1.5): -3,59 19,59 19,21 28,21 28,-3 -2,-3 -3,-2
  pour Bottom (isolate 2, no thermals): -5,100 -5,-10 180,-10 180,110 -5,110
I_LIM_SSR
  Bottom 0.152: EFUSE1.11/VREF 82.6,73 88.4,78.8 140.4,78.8 147,85.4 147,86 147.79,86.8 154.25,86.8 154.4,86.95 J2.4
I_SENSE_BRDG  (1 unrouted)
I_SENSE_SSR
  Bottom 0.152: EFUSE1.9/-VLOAD_SW 80.46,74.3 82.3,74.3 87.6,79.6 139.9,79.6 144,83.7 144,85.97 145.33,87.3 151.4,87.3 J2.3
INA_H
  Bottom 0.152: 125.03,62.27 J2.11 | BRDG_A.10/IN_H 9.4,57.3 97.5,57.3
  Bottom 0.203: 97.5,57.3 101.7,61.5 124.25,61.5 125.03,62.27
INA_L
  Bottom 0.152: J2.12 122.15,56.4 10.7,56.4 8.2,53.9 5.94,53.9 BRDG_A.9/IN_L
INB_H
  Bottom 0.152: BRDG_B.10/IN_H 128.44,55.14 154.4,81.1 J2.13
INB_L
  Bottom 0.152: J2.14 157.4,81.1 130.2,53.9 107.04,53.9 105.8,55.14 BRDG_B.9/IN_L
N$2
  Top 0.813: D12IN.A 164.5,53.7 12VIN.1
N$3
  pour Top (isolate 0.5, no thermals): 44,2 44,20 55,20 55,10 48,10 48,2
N$4
  pour Top (isolate 0.5, no thermals): 148,20 157,20 157,1 144,1 144,22 148,22
N$5  (1 unrouted)
N$20
  Top 0.406: RLD3.1 L_12V.A
NTCA+  (via drill 0.35)
  Route2 0.203: v117.7,81.9 123.5,81.9 123.5,68.61 v117.7,68.61
  Bottom 0.203: BRDG_A.7/NTC+ 6.02,59 9.2,59 10.7,60.5 20.6,60.5 23,58.1 94.4,58.1 104.91,68.61 v117.7,68.61 | J2.7 156.35,95.7 144.3,95.7 141.7,93.1 141.7,85 138.6,81.9 v117.7,81.9
NTCA-  (via drill 0.35)
  Route2 0.203: v116.6,82.6 124.3,82.6 124.3,67.7 v117.7,67.7
  Bottom 0.203: BRDG_A.8/NTC- 8.88,57.68 11.34,60.14 20.46,60.14 22.86,57.74 94.55,57.74 104.5,67.7 v117.7,67.7 | J2.8 158.65,96.4 143.6,96.4 141.05,93.85 141.05,85.45 138.2,82.6 v116.6,82.6
NTCB+  (via drill 0.35)
  Route2 0.203: v118,59.05 v139.3,59.05
  Bottom 0.203: BRDG_B.7/NTC+ 107.02,59 115.7,59 115.75,59.05 v118,59.05 | v139.3,59.05 139.55,59.05 166.15,85.65 J2.17
NTCB-  (via drill 0.35)
  Route2 0.203: v118,58.15 v139.3,58.15
  Bottom 0.203: BRDG_B.8/NTC- 108.76,58.2 115.7,58.2 115.75,58.15 v118,58.15 | v139.3,58.15 139.78,58.15 165.53,83.9 167.65,83.9 J2.18
VSS_A
  Top 1.27: 47.4,26.5 47.44,26.46 BRDG_A.3/VSSA 59.24,26.46 59.6,26.1 | U$13.7/IP- 62.72,31.28 62.7,31.3 | U$13.8/IP- 63.82,31.28 61.5,33.6
  pour Top (isolate 1.5, no thermals): 62,23 22,23 22,101 37,101 37,39 62,39
  pour Top (isolate 1.5, no thermals): 70,32 55,32 55,23 70,23
VSS_B
  pour Route2 (isolate 1.5, no thermals): 61,28 89,28 89,42 95,42 95,25 157,25 157,36 118,36 118,103 97,103 97,59 61,59
  pour Top (isolate 1.5, no thermals): 97,85 116,85 116,98 97,98

### Text on the board
tNames: !EFUSE / !RST | EFUSE / TRIP | I_SENSE / LSSR | I_LIM / SSR | I_SENSE / BRDG | OCD / EXT | NC | NC | NC | GND | INA_H | INA_L | INB_H | INB_L | QNA_H / EN | QNB_H / EN | NC | NC | GND | 190VDC (MAX) / 25A (CONT. MAX) / ***EFUSE PROTECTED | FBPS MOBO 0.0.1
bNames: - | +